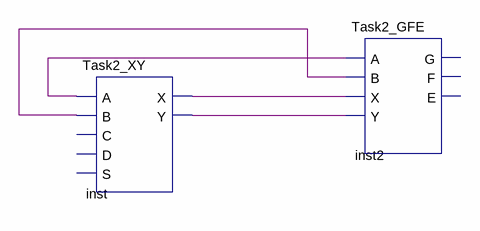
[diagram p0: schematic sheet]
// Quartus schematic Task2_Combination.bdf as structural Verilog: 2 symbols, 0 pins
module Task2_Combination (
);

  wire inst_x, inst_y, undriven, undriven_2;

  Task2_XY inst (.A(undriven), .B(undriven_2), .X(inst_x), .Y(inst_y));  // open: C, D, S
  Task2_GFE inst2 (.A(undriven), .B(undriven_2), .X(inst_x), .Y(inst_y));  // open: G, F, E
endmodule
